# EAGLE design MODULO_TECLADO (EAGLE 7.5.0)
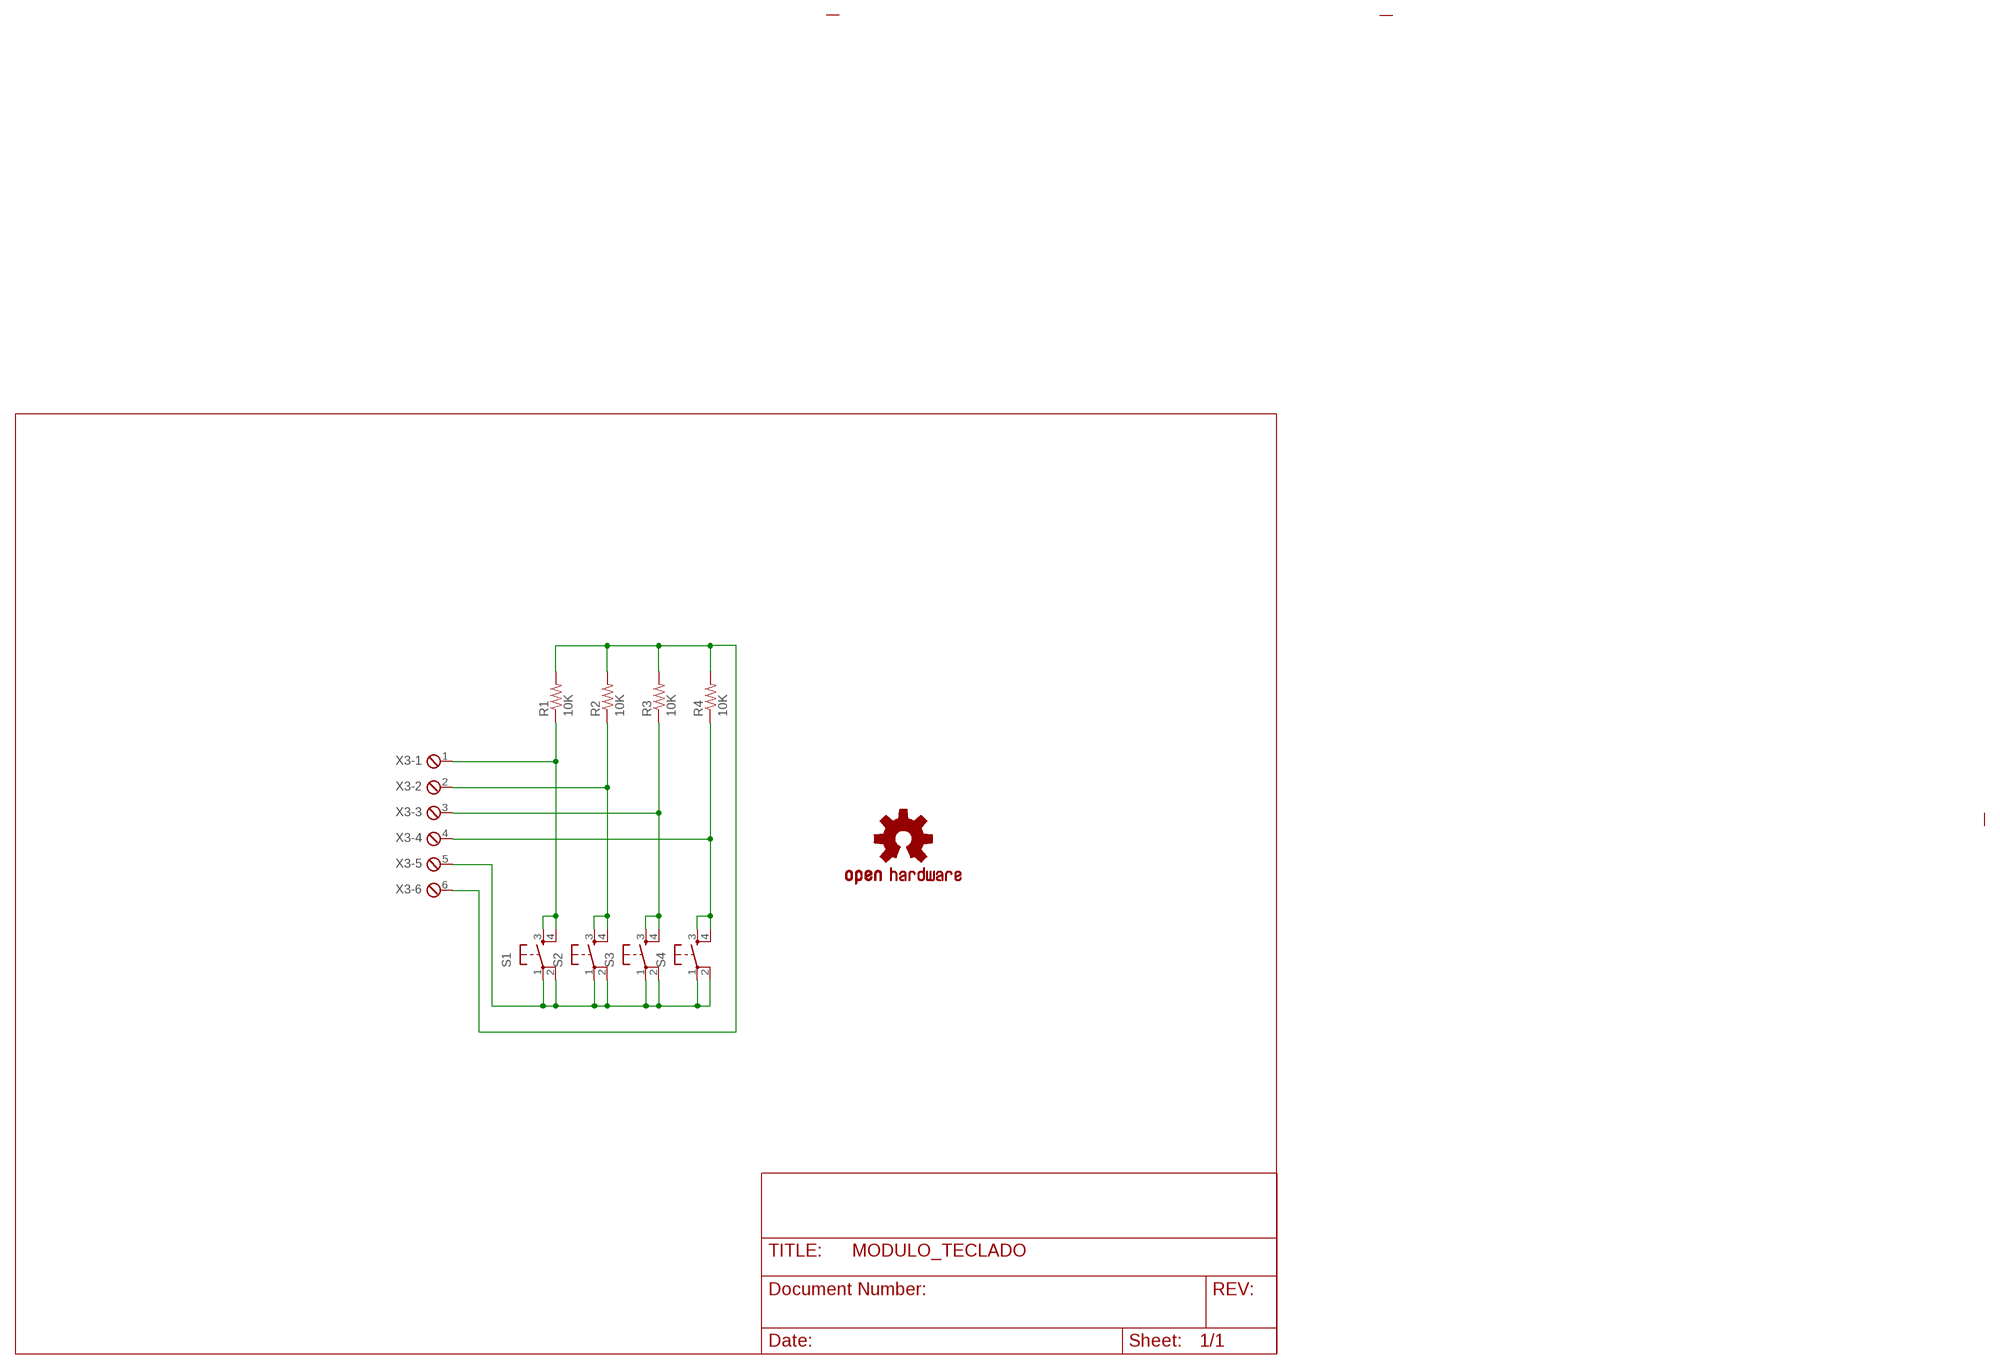
[diagram p0: schematic, sheet 1]

## Parts
LOGO1  OSHW-LOGOL  [OSHW-LOGO-L]
R1  10K  RESISTORPTH-1/4W  [AXIAL-0.4]
R2  10K  RESISTORPTH-1/4W  [AXIAL-0.4]
R3  10K  RESISTORPTH-1/4W  [AXIAL-0.4]
R4  10K  RESISTORPTH-1/4W  [AXIAL-0.4]
S1  TAC_SWITCHPTH  [TACTILE-PTH]
S2  TAC_SWITCHPTH  [TACTILE-PTH]
S3  TAC_SWITCHPTH  [TACTILE-PTH]
S4  TAC_SWITCHPTH  [TACTILE-PTH]
X3  MPT6  [6POL254]

## Nets
N$1: R1.P$1 S1.3 S1.4 X3.1
N$2: R2.P$1 S2.3 S2.4 X3.2
N$3: R3.P$1 S3.3 S3.4 X3.3
N$4: R4.P$1 S4.3 S4.4 X3.4
N$9: S1.1 S1.2 S2.1 S2.2 S3.1 S3.2 S4.1 S4.2 X3.5
N$10: R1.P$2 R2.P$2 R3.P$2 R4.P$2 X3.6

## Library data of the parts
LOGO1 = SparkFun-Aesthetics:OSHW-LOGO: Open Source Hardware Logo This logo indicates the piece of hardware it is found on incorporates a OSHW license and/or adheres to the definition of open source hardware found here: http://freedomdefined.org/OSHW
R1-R4 = SparkFun:RESISTOR: Resistor Basic schematic elements and footprints for 0603, 1206, and PTH resistors.
S1-S4 = SparkFun:TAC_SWITCH: Momentary Switch Button commonly used for reset or general input. Spark Fun Electronics SKU : COM-00097
X3 = con-phoenix-254:MPT6: PHOENIX CONNECTOR; OC_FARNELL: unknown; OC_NEWARK: unknown

## Board
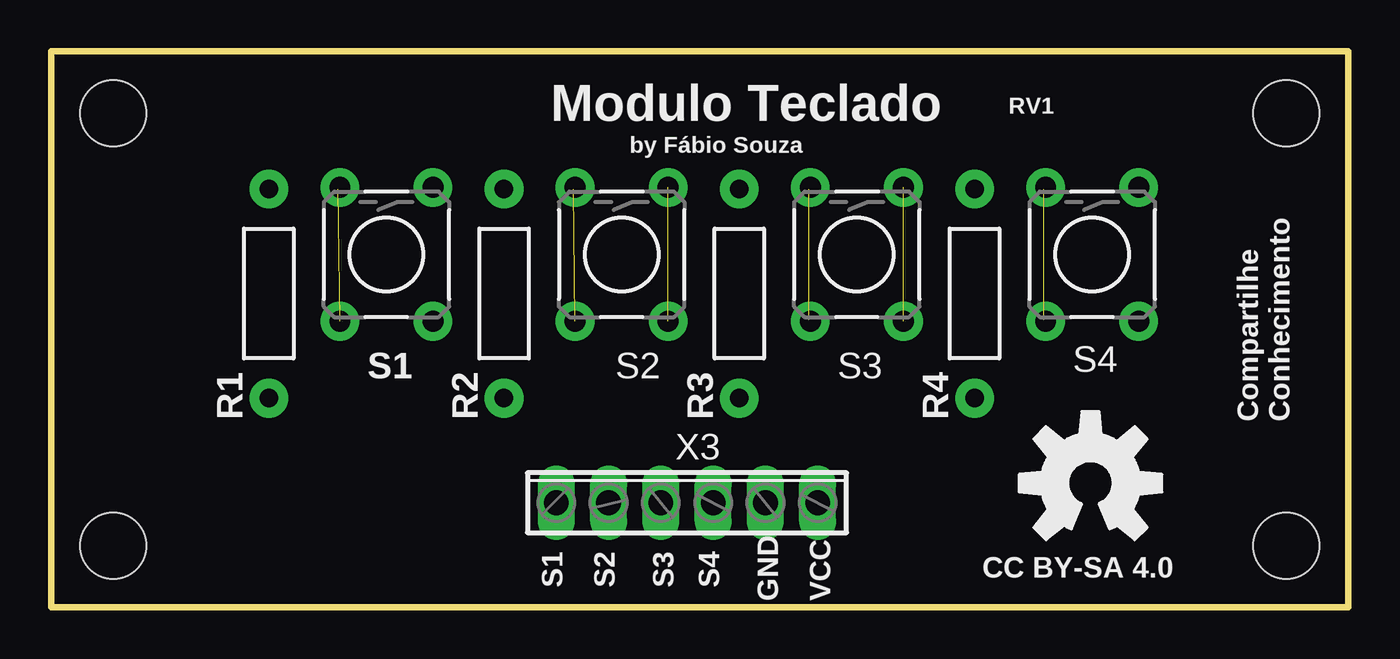
[diagram p1: board, top side]
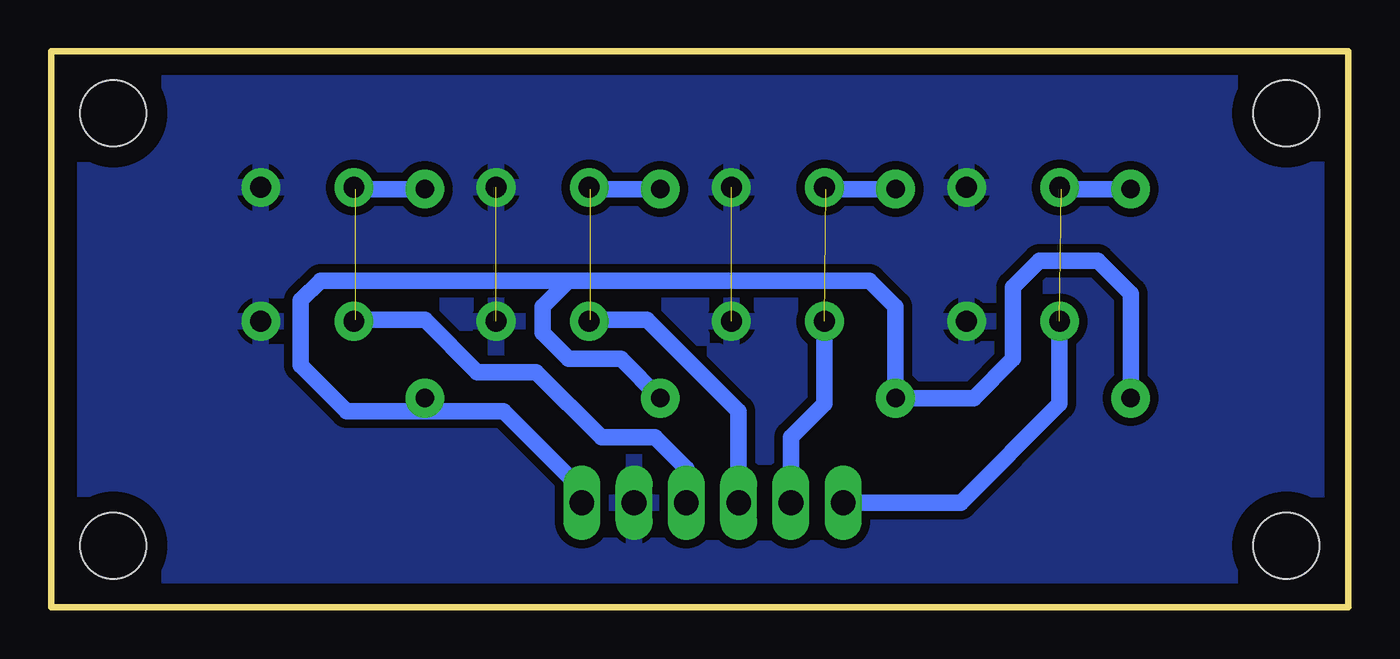
[diagram p2: board, bottom side, seen from below]

Size 63 x 27 mm. Coordinates in mm from the lower left corner, seen from the top.
Outline: 63,27 63,0 0,0 0,27 63,27
Copper layers (1*16): Top 0.035mm / dielectric 1.5mm / Bottom 0.035mm
Design rules "default": minimum track width 10mil, minimum drill 24mil, track to track 8mil, track to pad 8mil, pad to pad 8mil, via to via 8mil, smd to smd 8mil, copper to edge 40mil, drill to drill 8mil, minimum pad ring 10mil, minimum via ring 8mil, stop-mask expansion 4mil, vias tented up to drill 0mil, thermal gap 10mil
Holes 3.2 mm at 3,24 3,3 60,3 60,24

### Footprints (pad centres in the part's own frame; a part is rotated, then mirrored left to right if it is on the bottom)
AXIAL-0.4 = drill 0.9 pad 1.88: P$1 -5.08,0; P$2 5.08,0
TACTILE-PTH = drill 1.016 pad 1.88: 1 -3.251,2.261; 2 3.251,2.261; 3 -3.251,-2.261; 4 3.251,-2.261
6POL254 = drill 1.2 pad 1.778 long: 1 -6.35,0; 2 -3.81,0; 3 -1.27,0; 4 1.27,0; 5 3.81,0; 6 6.35,0

### Placement (x,y rotation side)
LOGO1  50.48,6.03 0 top
R1  10.56,15.24 270 top
R2  21.99,15.24 270 top
R3  33.42,15.24 270 top
R4  44.85,15.24 270 top
S1  16.27,17.14 270 top
S2  27.7,17.14 270 top
S3  39.13,17.14 270 top
S4  50.56,17.14 270 top
X3  30.88,5.08 0 top

### Tracks (layer width: path | path; a pad name or v marks a point on that pad's centre or on a via)
N$1  (1 unrouted)
  Bottom 0.813: S1.4 14.01,9.88 18.82,5.08 X3.1 | R1.P$1 13.94,20.32 S1.3
N$2  (1 unrouted)
  Bottom 0.813: S2.4 25.44,9.88 27.07,8.26 X3.2 | R2.P$1 25.37,20.32 S2.3
N$3  (1 unrouted)
  Bottom 0.813: X3.3 29.61,9.53 34.05,13.97 36.8,13.97 S3.4 | R3.P$1 36.8,20.32 S3.3
N$4  (1 unrouted)
  Bottom 0.813: X3.4 32.15,6.74 33.67,8.26 36.28,8.26 39.45,11.43 42.31,11.43 44.85,13.97 48.23,13.97 S4.4 | R4.P$1 48.23,20.32 S4.3
N$9  (2 unrouted)
  pour Bottom (isolate 0.406): 0.4,0 0.4,26.35 61.36,26.04 61.36,0
N$10
  Bottom 0.813: R1.P$2 10.56,15.24 12.15,16.83 15.01,16.83 16.27,15.56 16.27,12.06 18.18,10.16 R2.P$2 21.99,14.61 23.26,15.88 37.87,15.88 | 37.87,15.88 39.13,14.61 39.13,13.34 37.87,12.06 35.33,12.06 R3.P$2 | X3.6 37.23,5.71 41.04,9.53 44.22,9.53 | 44.22,9.53 R4.P$2 | 44.22,9.53 48.66,9.53 50.88,11.75 50.88,14.92 49.93,15.88 37.87,15.88

### Text on the board
tNames: Modulo Teclado | RV1 | by Fábio Souza | Compartilhe / Conhecimento | S1 | S2 | S3 | S4 | CC BY-SA 4.0 | GND | VCC